# Altium schematic sheet Célula 2.SchDoc
size A
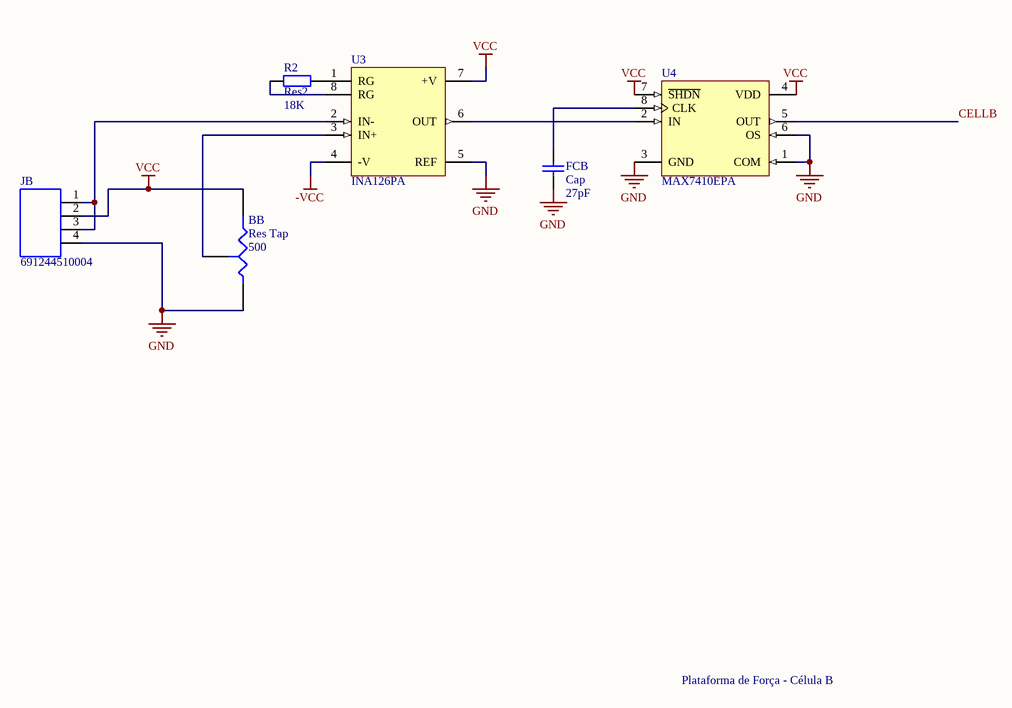
[diagram p0: Célula 2.SchDoc]

## Parts
BB  Res Tap  value 500  [TSR3006]
FCB  Cap  value 27pF  [RAD-0.3]
JB  691244510004  [691244510004]
R2  Res2  value 18K  [AXIAL-0.4]
U3  INA126PA  [006E]
U4  MAX7410EPA  [PA8]

## Nets
-VCC: U3.4(-V)
GND: BB.1(A) FCB.1 JB.4 U3.5(REF) U4.1(COM) U4.3(GND) U4.6(OS)
VCC: BB.2(B) JB.2 U3.7(+V) U4.4(VDD) U4.7(~{SHDN})
CELLB: U4.5(OUT)
NetBB_3: BB.3(TAP) U3.3(IN+)
NetFCB_2: FCB.2 U4.8(CLK)
NetJB_1: JB.1 JB.3 U3.2(IN-)
NetR2_1: R2.1 U3.8(RG)
NetR2_2: R2.2 U3.1(RG)
NetU3_6: U3.6(OUT) U4.2(IN)

## Notes on the sheet
- Plataforma de Força - Célula B

## Library data of the parts
BB = Res Tap: Tapped Resistor; Sim Note: Enter the Resistance value and the set point into parameter fields.; Set Position: 0.5; Published: 24-Mar-1999; LatestRevisionDate: 17-Jul-2002; LatestRevisionNote: Re-released for DXP Platform.; PackageReference: VR3; Publisher: Altium Limited; PackageDescription: Variable Resistor, Thru-Hole; 3 Leads
FCB = Cap: Capacitor; Published: 8-Jun-2000; LatestRevisionDate: 17-Jul-2002; LatestRevisionNote: Re-released for DXP Platform.; PackageReference: RAD-0.3; Publisher: Altium Limited; PackageDescription: Radial Cap, Thru-Hole; 2 Leads; 0.3 in Pin Spacing
JB = 691244510004: WR-TBL Horizontal Cable Entry With Rising Cage Clamp,Serie 2445 - 5.08 mm; Manufacturer: Wurth Elektronik; ComponentLink1 Description: Manufacturer; ComponentLink2 Description: Datasheet; ComponentLink1URL: http://www.we-online.de; ComponentLink2URL: http://katalog.we-online.de/em/datasheet/6912445100XX.pdf; Created by: Baojun Chen; Created Date: 15.Sep.2015; partNo: 691244510004
R2 = Res2: Resistor; Published: 8-Jun-2000; LatestRevisionDate: 17-Jul-2002; LatestRevisionNote: Re-released for DXP Platform.; PackageReference: AXIAL-0.4; Publisher: Altium Limited; PackageDescription: Axial Device, Thru-Hole; 2 Leads; 0.4 in Pin Spacing
U3 = INA126PA: Precision, Low-Power Instrumentation Amplifiers; Published: 8-Jun-2000; LatestRevisionDate: 06-Jun-2005; LatestRevisionNote: Stylized 3D Model Added.; DatasheetVersion: Oct-1996; PackageVersion: revE; PackageReference: 006E; Publisher: Altium Limited; PackageDescription: DIP; 8 Leads; Row Spacing 7.62 mm; Pitch 2.54 mm; ComponentLink1Description: Manufacturer Link; ComponentLink1URL: http://www.ti.com/; ComponentLink2Description: Datasheet; ComponentLink2URL: http://www-s.ti.com/sc/ds/INA128.pdf
U4 = MAX7410EPA: 5th-Order, Lowpass, Switched-Capacitor Filter; Published: 16-Jan-2001; LatestRevisionDate: 29-May-2009; LatestRevisionNote: Component Body Added.; DatasheetVersion: Sep-1998; PackageVersion: RevB, 21-0043; PackageReference: PA8; Publisher: Altium Limited; PackageDescription: DIP, 8-Pin, Row Spacing 7.62 mm, Pitch 2.54 mm; Code_JEDEC: MS-001-AB; ComponentLink1Description: Manufacturer Link; ComponentLink1URL: http://www.maxim-ic.com/; ComponentLink2Description: Datasheet; ComponentLink2URL: http://pdfserv.maxim-ic.com/en/ds/MAX7409-MAX7414.pdf